# EAGLE design pd25 (EAGLE 6.5.0)
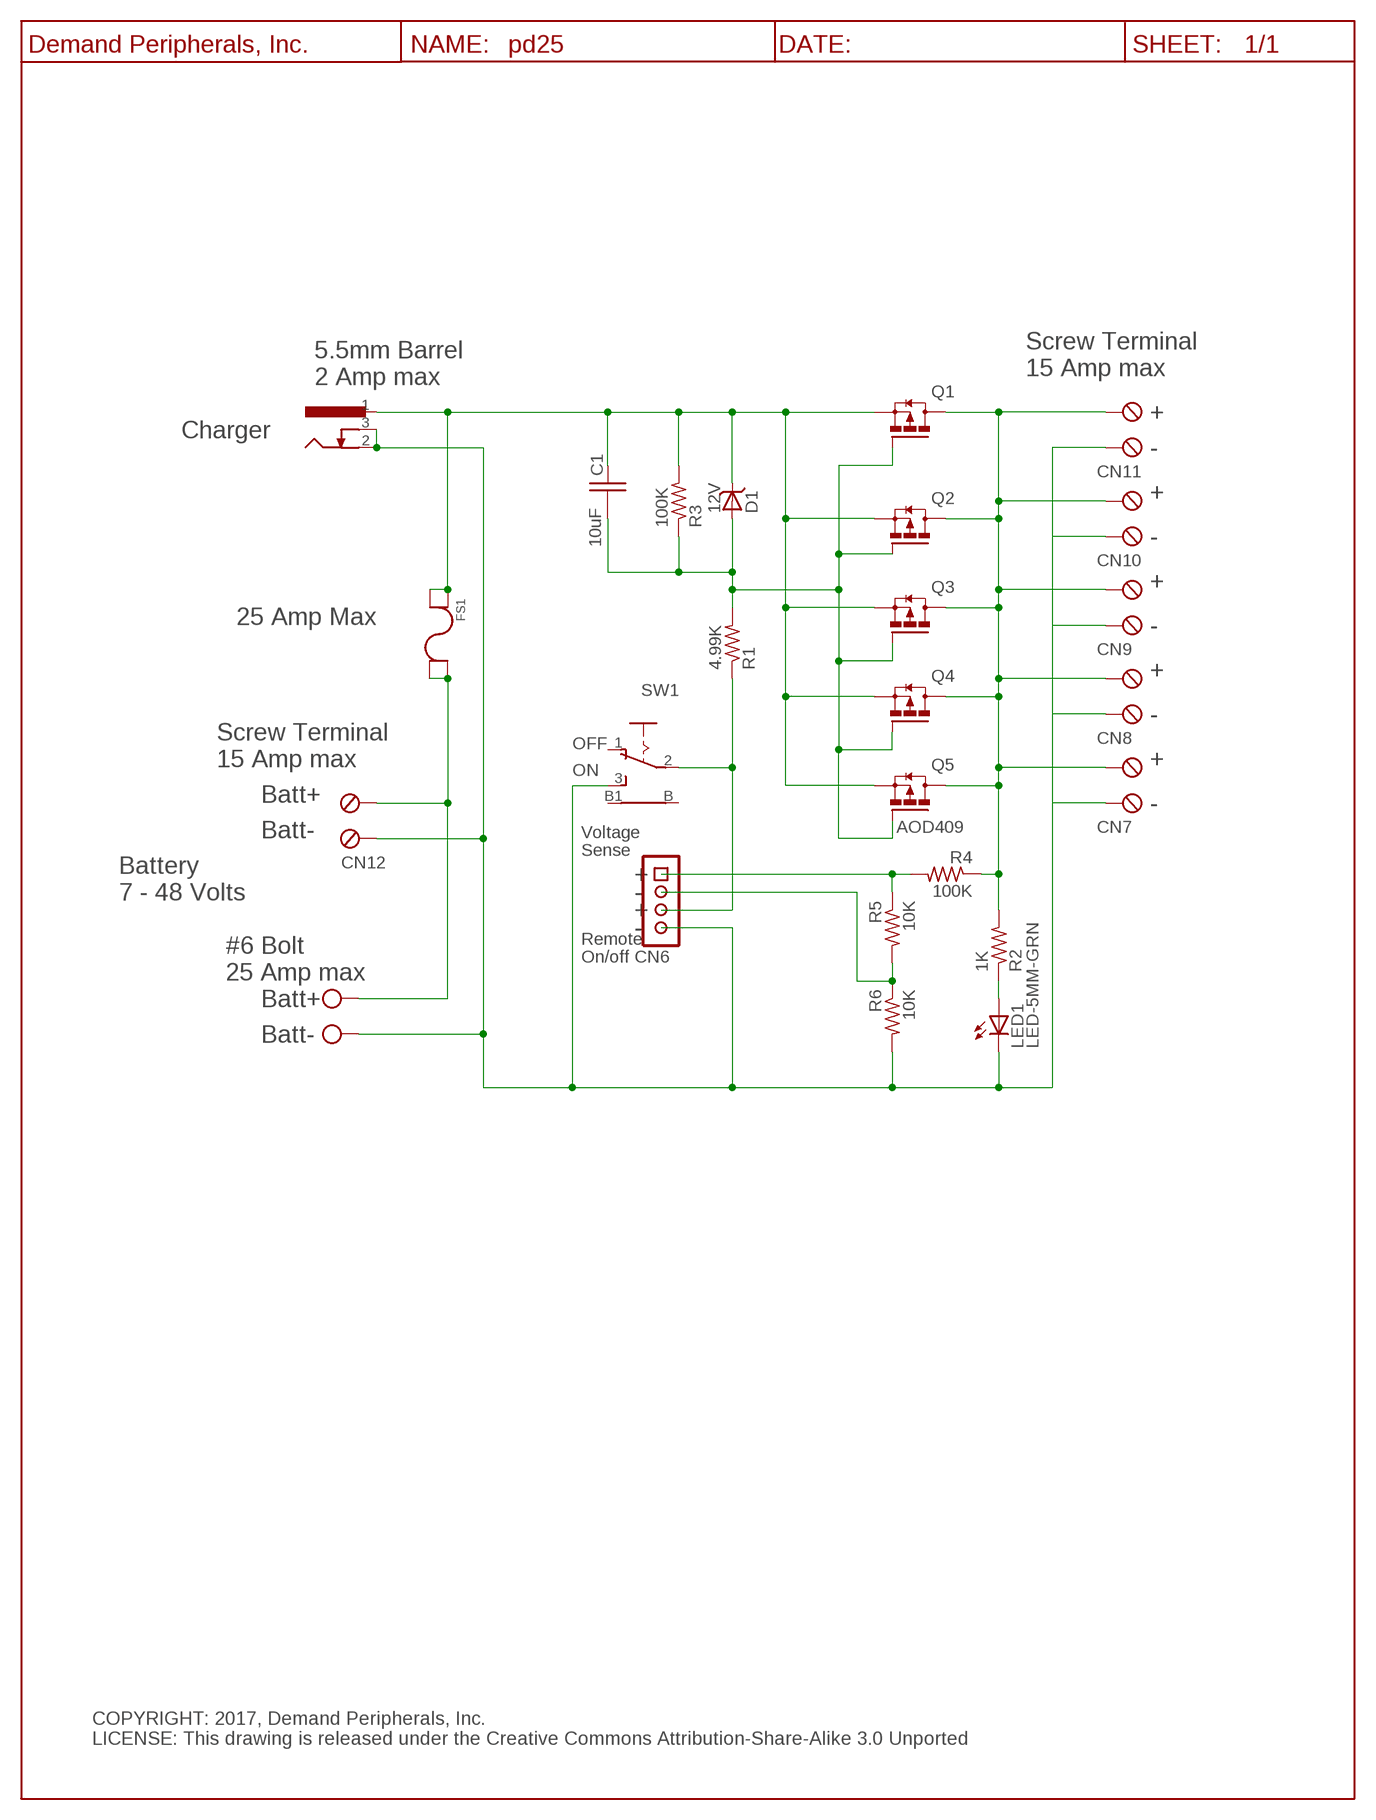
[diagram p0: schematic, sheet 1]

## Parts
BATT+  Bolt_Connection  BOLT_6  [BOLT_6]
BOLT1  Bolt_Connection  BOLT_6  [BOLT_6]
C1  10uF  C10UF35V_C0805  [C0805]
CN6  HDR-4X1-LCK  [HDR-4X1]
CN7  TBLK-5.08-X2  [TBLK-5.08-X2]
CN8  TBLK-5.08-X2  [TBLK-5.08-X2]
CN9  TBLK-5.08-X2  [TBLK-5.08-X2]
CN10  TBLK-5.08-X2  [TBLK-5.08-X2]
CN11  TBLK-5.08-X2  [TBLK-5.08-X2]
CN12  TBLK-5.08-X2  [TBLK-5.08-X2]
D1  12V  BZT52C12  [SOD123]
FS1  FUSE-KS3557  [KS3557-10]
J1  Barrel-5.5mm  DC-BARREL-JACK--55MM  [DC-BARREL-JACK-55MM]
LED1  LED-5MM-GRN  [LED5MM]
Q1  FET_DPAK_P  AOD409  [DPACK_TO-252]
Q2  FET_DPAK_P  AOD409  [DPACK_TO-252]
Q3  FET_DPAK_P  AOD409  [DPACK_TO-252]
Q4  FET_DPAK_P  AOD409  [DPACK_TO-252]
Q5  AOD409  [DPACK_TO-252]
R1  4.99K  R4.99K_R0603  [R0603]
R2  1K  R1K_R0603  [R0603]
R3  100K  R100K_R0603  [R0603]
R4  100K  R100K_R0603  [R0603]
R5  10K  R10K_R0603  [R0603]
R6  10K  R10K_R0603  [R0603]
SW1  TOGGLE_SPDT_PC  [TOGGLE_SPDT_PC]
U$1  DP_FRAME_P  [P_FRAME]

## Nets
BATT+: BATT+.P CN12.2(KL1) FS1.RS@3(RS) FS1.RS@4(RS)
FUSE+: C1.1 D1.C FS1.LS@1(LS) FS1.LS@2(LS) J1.1 Q1.3(S) Q2.3(S) Q3.3(S) Q4.3(S) Q5.3(S) R3.2
GND: BOLT1.P CN6.4 CN7.1(KL) CN8.1(KL) CN9.1(KL) CN10.1(KL) CN11.1(KL) CN12.1(KL) J1.2 J1.3 LED1.C R6.2 SW1.3(S)
N$1: LED1.A R2.1
N$5: CN6.1 R4.2 R5.1
N$6: CN6.2 R5.2 R6.1
N$10: C1.2 D1.A Q1.1(G) Q2.1(G) Q3.1(G) Q4.1(G) Q5.1(G) R1.2 R3.1
ON+: CN6.3 R1.1 SW1.2(P)
V+: CN7.2(KL1) CN8.2(KL1) CN9.2(KL1) CN10.2(KL1) CN11.2(KL1) Q1.4(D) Q2.4(D) Q3.4(D) Q4.4(D) Q5.4(D) R2.2 R4.1
Unconnected: SW1.1(O) SW1.B SW1.B1

## Notes on the sheet
- Screw Terminal
- 5.5mm Barrel
- 15 Amp max
- 2 Amp max
- +
- Charger
- -
- +
- -
- +
- 25 Amp Max
- -
- +
- -
- Screw Terminal
- OFF
- 15 Amp max | +
- ON
- Batt+
- -
- Batt- | Voltage
- Sense
- Battery
- +
- 7 - 48 Volts | -
- +
- -
- Remote
- #6 Bolt
- On/off
- 25 Amp max
- Batt+
- Batt-
- COPYRIGHT: 2017, Demand Peripherals, Inc.
  LICENSE: This drawing is released under the Creative Commons Attribution-Share-Alike 3.0 Unported

## Library data of the parts
BATT+ BOLT1 = dpi-conn:BOLT_6: Screw mount pad square. Medium fit.; VENDOR: OSH; VENDOR-PART-NUM: xxxxx
C1 = dpi-passive:C10UF35V_: 10 uF Capacitor, 35V, X6S; VENDOR: Digikey; VENDOR-PART-NUM: 490-10504-2-ND
CN6 = dpi-conn:HDR-4X1-LCK: 4x1 pin header with friction lock; VENDOR: Digikey; VENDOR-PART-NUM: A1922-ND
CN7-CN12 = dpi-conn:TBLK-5.08-X2: Terminal Block, 5.08mm, x2, screw terminals; VENDOR: Digikey; VENDOR-PART-NUM: ED2609-ND
D1 = dpi-diopto:BZT52C12: BZT52C12 12 volt Zener, 500 mW; VENDOR: Digikey; VENDOR-PART-NUM: BZT52C1213-FDICT-ND
FS1 = dpi-conn:FUSE-KS3557: Automotive fuse holder; VENDOR: Digikey; VENDOR-PART-NUM: 36-3557-10-ND
J1 = dpi-conn:DC-BARREL-JACK--55MM: 5.5 mm DC POWER JACK, CUI PJ-102AH; VENDOR: Digikey; VENDOR-PART-NUM: CP-102AH-ND
LED1 = dpi-diopto:LED-5MM-GRN: Green LED, 5 MM, through-hole; VENDOR: Digikey; VENDOR-PART-NUM: 160-1852-ND
Q1-Q5 = dpi-transic:AOD409: FET P-channel D-PAK w/diode; VENDOR: Digikey; VENDOR-PART-NUM: 785-1103-1-ND
R1 = dpi-passive:R4.99K_: 4.99K Resistor, 1%, 0.1 watt; VENDOR: Digikey; VENDOR-PART-NUM: 311-4.99KHRTR-ND
R2 = dpi-passive:R1K_: 1K Resistor, 1%, 0.1 watt; VENDOR: Digikey; VENDOR-PART-NUM: 311-1.00KHRTR-ND
R3 R4 = dpi-passive:R100K_: 100K Resistor, 1%, 0.1 watt; VENDOR: Digikey; VENDOR-PART-NUM: 311-100KHRTR-ND
R5 R6 = dpi-passive:R10K_: 10K Resistor, 1%, 0.1 watt; VENDOR: Digikey; VENDOR-PART-NUM: 311-1.00KHRTR-ND
SW1 = dpi-swsens:TOGGLE_SPDT_PC: SPDT TOGGLE SWITCH; VENDOR: Digikey; VENDOR-PART-NUM: CKN1454-ND
U$1 = dpi-sym:DP_FRAME_P: Portrait/Letter Document Frame

## Board
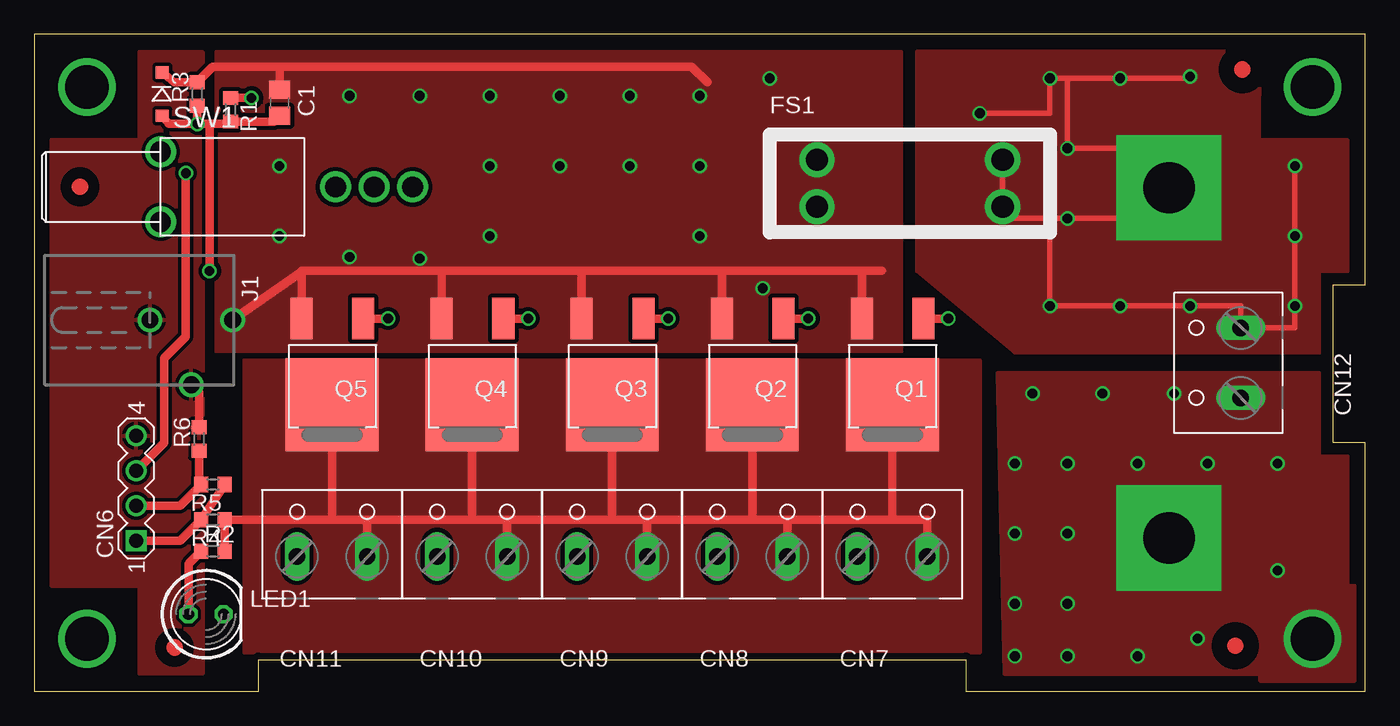
[diagram p1: board, top side]
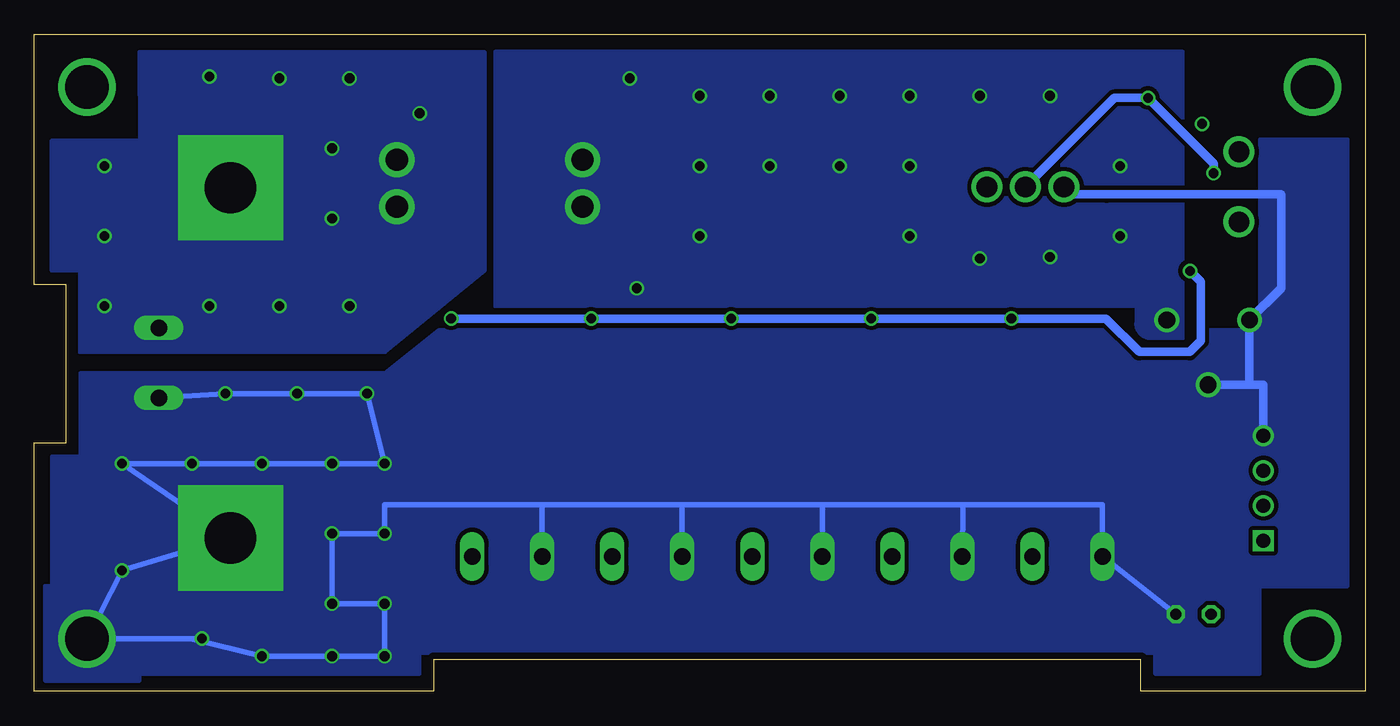
[diagram p2: board, bottom side, seen from below]

Size 96.52 x 47.62 mm. Coordinates in mm from the lower left corner, seen from the top.
Outline: 96.52,47.62 0,47.62 0,0 16.26,0 16.26,2.29 67.56,2.29 67.56,0 96.52,0 96.52,18.03 94.23,18.03 94.23,29.46 96.52,29.46 96.52,47.62
Copper layers (1*16): Top 0.035mm / dielectric 1.5mm / Bottom 0.035mm
Design rules "Fusion_eagle_rule_v1.1 *": minimum track width 6mil, minimum drill 12mil, track to track 10mil, track to pad 10mil, pad to pad 10mil, via to via 10mil, smd to smd 0mil, copper to edge 20mil, drill to drill 10mil, minimum pad ring 10mil, minimum via ring 6mil, stop-mask expansion 2mil, vias tented up to drill 10mil, thermal gap 10mil

### Footprints (pad centres in the part's own frame; a part is rotated, then mirrored left to right if it is on the bottom)
BOLT_6 = drill 3.729 pad 7.62 square: P 0,0
C0805 = smd 1.3 x 1.5: 1 -0.95,0; 2 0.95,0
HDR-4X1 = drill 1.016 square: 1 -3.81,0 | drill 1.016: 2 -1.27,0; 3 1.27,0; 4 3.81,0
TBLK-5.08-X2 = drill 1.194 long: 1 -2.54,-0.127; 2 2.54,-0.127
SOD123 = smd 0.9 x 0.95: A 1.575,0; C -1.575,0
KS3557-10 = drill 1.6 pad 2.54: LS@1 -6.731,-1.702; LS@2 -6.731,1.702; RS@3 6.731,1.702; RS@4 6.731,-1.702
DC-BARREL-JACK-55MM = drill 1.2: 1 0,5.994; 2 0,0; 3 4.699,2.997
LED5MM = drill 0.813 octagon: A -1.27,0; C 1.27,0
DPACK_TO-252 = smd 1.6 x 2.997: 1 -2.261,-4.928; 3 2.21,-4.928 | smd 6.731 x 6.731: 4 0,1.321
R0603 = smd 1 x 1.1: 1 -0.85,0; 2 0.85,0
TOGGLE_SPDT_PC = drill 1.5 pad 1.676: 1 18.288,0; 2 15.494,0; 3 12.7,0 | drill 1.5 pad 1.778: B 0,-2.54; B1 0,2.54

### Placement (x,y rotation side)
BATT+  82.3,36.51 180 top
BOLT1  82.3,11.11 270 top
C1  17.78,42.67 270 top
CN6  7.37,14.73 90 top
CN7  62.23,9.91 0 top
CN8  52.07,9.91 0 top
CN9  41.91,9.91 0 top
CN10  31.75,9.91 0 top
CN11  21.59,9.91 0 top
CN12  87.38,23.81 90 top
D1  9.27,43.31 270 top
FS1  63.5,36.83 0 top
J1  8.38,26.92 270 top
LED1  12.45,5.59 0 top
Q1  62.23,22.1 180 top
Q2  52.07,22.1 180 top
Q3  41.91,22.1 180 top
Q4  31.75,22.1 180 top
Q5  21.59,22.1 180 top
R1  14.22,42.16 270 top
R2  12.95,10.16 0 top
R3  11.81,43.31 90 top
R4  12.95,12.45 180 top
R5  12.94,14.99 180 top
R6  11.94,18.29 90 top
SW1  9.14,36.58 0 top
U$1  -2.54,-2.54 0 top
U$3  [FIDUCIAL]  87.12,3.3 180 top
U$4  [FIDUCIAL]  87.63,45.09 180 top
U$6  [FIDUCIAL]  10.16,3.17 180 top
U$8  [DPI-2]  40.64,32.51 0 bottom
U$12  [FIDUCIAL]  3.3,36.58 180 top

### Tracks (layer width: path | path; a pad name or v marks a point on that pad's centre or on a via)
BATT+  (via drill 0.7)
  Top 0.406: 73.81,34.29 v74.93,34.29 82.3,34.29 BATT+.P 82.3,39.37 v74.93,39.37 74.93,44.45 | 73.81,34.29 73.66,34.29 v73.66,27.94 v78.74,27.94 v83.82,27.94 87.5,27.94 CN12.2 91.44,26.35 v91.44,27.94 v91.44,33.02 v91.44,38.1 | v68.58,41.91 73.66,41.91 v73.66,44.45 74.93,44.45 | 74.93,44.45 v78.74,44.45 83.82,44.45 v83.82,44.58 | FS1.RS@3 FS1.RS@4 71.07,34.29 73.81,34.29
  pour Top (isolate 0.305, no thermals): 71.12,24.57 93.22,24.57 93.22,30.48 95.25,30.48 95.25,39.95 88.85,39.95 88.9,46.35 64.01,46.35 64.01,30.48
  pour Bottom (isolate 0.305, no thermals): 71.12,24.57 93.22,24.57 93.22,30.48 95.25,30.48 95.25,39.95 88.85,39.95 88.9,46.35 63.88,46.35 63.88,30.48
FUSE+  (via drill 0.7)
  Top 0.61: D1.C 10.12,44.16 R3.2 12.94,45.29 15.47,45.29 17.73,45.29 | J1.1 19.48,30.48 | 19.48,30.48 29.57,30.48 | 29.57,30.48 39.79,30.48 | 39.79,30.48 49.92,30.48 | 49.92,30.48 60.1,30.48 | 60.1,30.48 61.47,30.48 | Q5.3 19.38,30.48 19.48,30.48 | Q4.3 29.54,30.48 29.57,30.48 | Q3.3 39.7,30.48 39.79,30.48 | Q2.3 49.86,30.48 49.92,30.48 | Q1.3 60.02,30.48 60.1,30.48 | 48.81,44.16 47.68,45.29 17.73,45.29 | C1.1 17.78,45.24 17.73,45.29
  other vias: 17.78,33.02 17.78,38.1 33.02,43.18 33.02,38.1 33.02,33.02 38.1,43.18 38.1,38.1 43.18,43.18 43.18,38.1 48.26,43.18 48.26,38.1 48.26,33.02 27.94,43.18 22.86,43.18 27.94,31.37 22.86,31.5 53.34,44.45 52.82,29.22
  pour Bottom (isolate 0.305, no thermals): 63.12,46.35 63.12,27.94 16.6,27.94 16.6,26.67 arc-90 15.56,25.63 13.21,25.63 13.21,46.35
  pour Top (isolate 0.305, no thermals): 62.87,46.35 62.87,24.64 13.21,24.64 13.21,46.35
GND  (via drill 0.7, 3.17 pad 3.17)
  Top 0.61: R6.2 11.94,21.67 J1.3
  Bottom 0.406: CN12.1 v82.68,21.59 v77.47,21.59 v72.39,21.59 v71.12,16.51 v74.93,16.51 v80.01,16.51 v85.09,16.51 v90.17,16.51 BOLT1.P v90.17,8.76 v92.71,3.81 85.2,3.81 | 85.2,3.81 v84.37,3.82 | 85.2,3.81 v80.01,2.54 v74.93,2.54 v71.12,2.54 v71.12,6.35 v74.93,6.35 v74.93,11.43 v71.12,11.43 71.12,13.51 59.7,13.51 | 29.18,13.51 20.05,13.51 19.05,13.51 CN11.1 LED1.C | 29.18,13.51 39.34,13.51 | 39.34,13.51 49.53,13.51 | 49.53,13.51 59.7,13.51 | 29.18,13.51 CN10.1 | 39.34,13.51 CN9.1 | 49.53,13.51 CN8.1 | 59.7,13.51 CN7.1
  Bottom 0.61: 8.38,22.23 J1.2 6.07,29.23 6.07,35.99 6.11,36.03 18.73,36.03 21.3,36.03 SW1.3 | 8.38,22.23 J1.3 | CN6.4 7.37,22.23 8.38,22.23
  pour Top: 7.62,1.27 7.62,7.62 1.27,7.62 1.27,40.01 7.62,40.01 7.62,46.35 12.19,46.35 12.19,1.27
  pour Bottom (isolate 0.305, no thermals): 93.22,23.05 93.22,17.02 95.25,17.02 95.25,7.62 95.76,7.62 95.76,0.76 88.9,0.76 88.9,1.27 68.58,1.27 68.58,2.79 15.24,2.79 15.24,1.27 7.62,1.27 7.62,7.62 1.27,7.62 1.27,40.01 7.62,40.01 7.62,26.16 67.22,26.16 71.12,23.05
  pour Top (isolate 0.305, no thermals): 69.85,23.05 70.36,1.27 88.9,1.27 88.9,0.76 95.76,0.76 95.76,7.62 95.25,7.62 95.25,17.02 93.22,17.02 93.22,23.05
MOUNT0  (via drill 3.17 pad 3.17)
  other vias: 92.71,43.81
MOUNT6  (via drill 3.17 pad 3.17)
  other vias: 3.81,43.81
MOUNT7  (via drill 3.17 pad 3.17)
  other vias: 3.81,3.81
N$1
  Top 0.61: R2.1 11.18,9.23 LED1.A
N$5
  Top 0.61: R5.1 R4.2 10.58,10.92 CN6.1
N$6
  Top 0.61: R6.1 11.94,15.14 R5.2 10.57,13.46 CN6.2
N$10  (via drill 0.7)
  Top 0.61: v66.29,27.03 Q1.1 | v56.13,27.03 Q2.1 | v45.97,27.03 Q3.1 | v35.81,27.03 Q4.1 | v25.65,27.03 Q5.1 | v11.81,41.15 R3.1 | D1.A 9.73,41.15 11.71,41.15 v11.81,41.15 | 12.74,41.15 v11.81,41.15 | 12.74,41.15 14.06,41.15 R1.2 17.37,41.31 C1.2 | v12.7,30.48 12.7,41.11 12.74,41.15
  Bottom 0.61: v66.29,27.03 v56.13,27.03 v45.97,27.03 v35.81,27.03 v25.65,27.03 18.8,27.03 16.38,24.61 12.71,24.61 11.93,25.4 11.93,29.7 v12.7,30.48
ON+  (via drill 0.7)
  Top 0.61: R1.1 14.24,43.03 v15.75,43.03 | CN6.3 9.4,18.03 9.4,24.13 10.99,25.72 v10.99,37.57
  Bottom 0.61: SW1.2 18.19,43.03 v15.75,43.03 10.99,38.27 v10.99,37.57
V+
  Top 0.61: 21.54,12.45 R4.1 R2.2 | 21.54,12.45 24.13,12.45 | 24.13,12.45 CN11.2 | 34.29,12.45 CN10.2 | 24.13,12.45 31.79,12.45 | 31.79,12.45 34.29,12.45 | 44.45,12.45 CN9.2 | 34.29,12.45 41.97,12.45 | 41.97,12.45 44.45,12.45 | 54.61,12.45 CN8.2 | 44.45,12.45 52.15,12.45 | 52.15,12.45 54.61,12.45 | CN7.2 64.77,12.45 62.22,12.45 | 54.61,12.45 62.22,12.45 | Q1.4 62.23,12.45 62.22,12.45 | Q2.4 52.07,12.45 52.15,12.45 | Q3.4 41.91,12.45 41.97,12.45 | Q4.4 31.75,12.45 31.79,12.45 | Q5.4 21.59,12.45 21.54,12.45
  pour Top (isolate 0.305, no thermals): 68.58,24 68.58,2.79 15.24,2.79 15.24,24

### Text on the board
tTest: 3.8 Inches | 3.5 Inches | 25A Max | R3 | R1 | C1 | D1 | S1 | FUSE | + | Batt | PD25, Rev 17A | (C) 2017, Demand Peripherals, Inc. | + | Rmt On | - | R6 | Q5 | Q4 | Q3 | Q2 | Q1 | - | R5 | + | 1.575 Inches | 1.875 Inches | V Sense | - | R4 | R2 | + | - | LED | Batt | - | + | - | + | - | + | - | + | - | +